# Altium schematic sheet Master.SchDoc
size A4; SheetNumber: 2; SheetTotal: 8
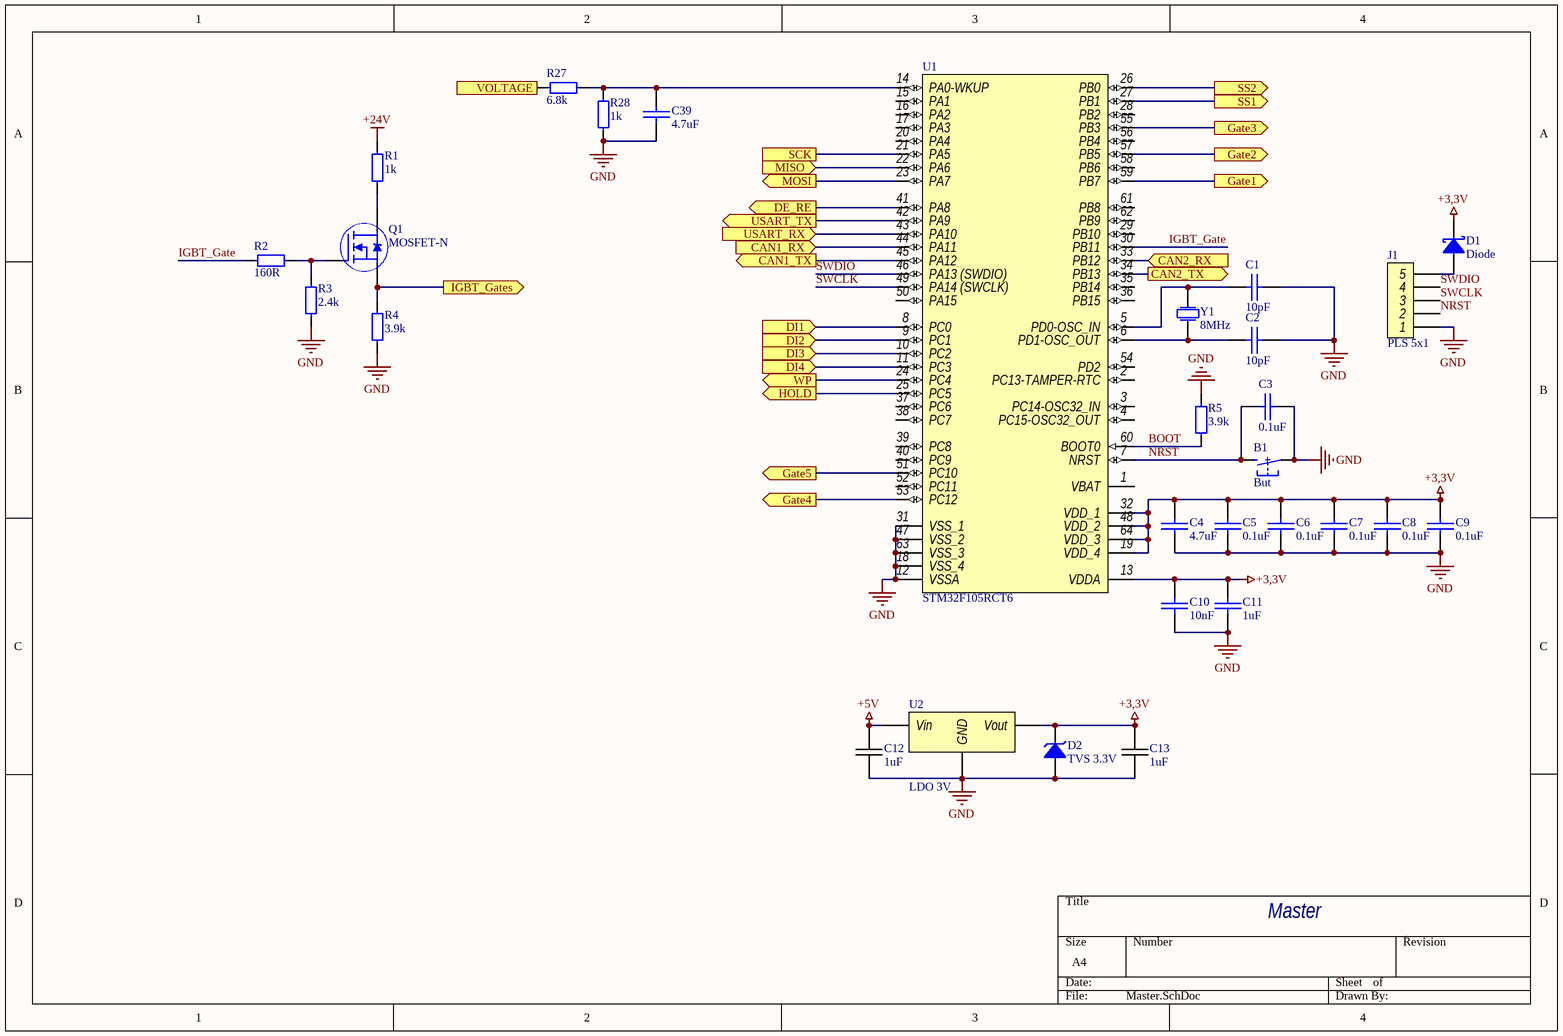
[diagram p0: Master.SchDoc]

## Parts
B1  But  [BUTTON 6x3.5]
C1  10pF  [0603 Capicator]
C2  10pF  [0603 Capicator]
C3  0.1uF  [0603 Capicator]
C4  4.7uF  [0603 Capicator]
C5  0.1uF  [0603 Capicator]
C6  0.1uF  [0603 Capicator]
C7  0.1uF  [0603 Capicator]
C8  0.1uF  [0603 Capicator]
C9  0.1uF  [0603 Capicator]
C10  10nF  [0603 Capicator]
C11  1uF  [0603 Capicator]
C12  1uF  [0603 Capicator]
C13  1uF  [0603 Capicator]
C39  4.7uF  [0603 Capicator]
D1  Diode  [sod-123]
D2  TVS 3.3V  [DO-216AA]
J1  PLS 5x1  [PLS 5x1]
Q1  MOSFET-N  [SOT-23]
R1  1k  [0603 Resistor]
R2  160R  [0603 Resistor]
R3  2.4k  [0603 Resistor]
R4  3.9k  [0603 Resistor]
R5  3.9k  [0603 Resistor]
R27  6.8k  [0603 Resistor]
R28  1k  [0603 Resistor]
U1  STM32F105RCT6  [LQFP64]
U2  LDO 3V  [SOT-23]
Y1  8MHz  [NX5032GA]

## Ports
CAN1_RX (in), CAN1_TX (out), CAN2_RX (in), CAN2_TX (out), DE_RE (out), DI1 (in), DI2 (in), DI3 (in), DI4 (in), Gate1 (out), Gate2 (out), Gate3 (out), Gate4 (out), Gate5 (out), HOLD (out), IGBT_Gates (out), MISO (in), MOSI (out), SCK, SS1 (out), SS2 (out), USART_RX (in), USART_TX (out), VOLTAGE (in), WP (out)

## Nets
+3,3V: C4.2 C5.2 C6.2 C7.2 C8.2 C9.2 C10.2 C11.2 C13.2 D1.2 D2.2 U1.13(VDDA) U1.19(VDD_4) U1.32(VDD_1) U1.48(VDD_2) U1.64(VDD_3) U2.2(Vout)
+5V: C12.2 U2.3(Vin)
+24V: R1.2
GND: B1.1 C1.2 C2.2 C3.2 C4.1 C5.1 C6.1 C7.1 C8.1 C9.1 C10.1 C11.1 C12.1 C13.1 C39.1 D2.1 J1.1 R3.1 R4.1 R5.2 R28.1 U1.12(VSSA) U1.18(VSS_4) U1.31(VSS_1) U1.47(VSS_2) U1.63(VSS_3) U2.1(GND)
BOOT: R5.1 U1.60(BOOT0)
CAN1_RX: U1.44(PA11) ; port CAN1_RX
CAN1_TX: U1.45(PA12) ; port CAN1_TX
CAN2_RX: U1.33(PB12) ; port CAN2_RX
CAN2_TX: U1.34(PB13) ; port CAN2_TX
DE_RE: U1.41(PA8) ; port DE_RE
DI1: U1.8(PC0) ; port DI1
DI2: U1.9(PC1) ; port DI2
DI3: U1.10(PC2) ; port DI3
DI4: U1.11(PC3) ; port DI4
Gate1: U1.59(PB7) ; port Gate1
Gate2: U1.57(PB5) ; port Gate2
Gate3: U1.55(PB3) ; port Gate3
Gate4: U1.53(PC12) ; port Gate4
Gate5: U1.51(PC10) ; port Gate5
HOLD: U1.25(PC5) ; port HOLD
IGBT_Gate: R2.1 U1.30(PB11)
IGBT_Gates: Q1.2(Source) R4.2 ; port IGBT_Gates
MISO: U1.22(PA6) ; port MISO
MOSI: U1.23(PA7) ; port MOSI
NRST: B1.2 C3.1 J1.2 U1.7(NRST)
SCK: U1.21(PA5) ; port SCK
SS1: U1.27(PB1) ; port SS1
SS2: U1.26(PB0) ; port SS2
SWCLK: J1.3 U1.49(PA14_(SWCLK))
SWDIO: J1.4 U1.46(PA13_(SWDIO))
USART_RX: U1.43(PA10) ; port USART_RX
USART_TX: U1.42(PA9) ; port USART_TX
VOLTAGE: R27.2 ; port VOLTAGE
WP: U1.24(PC4) ; port WP
NetC1_1: C1.1 U1.5(PD0-OSC_IN) Y1.2
NetC2_1: C2.1 U1.6(PD1-OSC_OUT) Y1.1
NetC39_2: C39.2 R27.1 R28.2 U1.14(PA0-WKUP)
NetD1_1: D1.1 J1.5
NetQ1_1: Q1.1(Gate) R2.2 R3.2
NetQ1_3: Q1.3(Drain) R1.1

Not connected (* = marked no-connect by the designer): U1 1(VBAT) 2(PC13-TAMPER-RTC) 3(PC14-OSC32_IN) 4(PC15-OSC32_OUT) 15(PA1) 16(PA2) 17(PA3) 20(PA4) 28(PB2) 29(PB10) 35(PB14) 36(PB15) 37(PC6) 38(PC7) 39(PC8) 40(PC9) 50(PA15) 52(PC11) 54(PD2) 56(PB4) 58(PB6) 61(PB8) 62(PB9)

## Notes on the sheet
- Master

## Library data of the parts
B1 = Button 2 Conn: Button 2 Conn SMD; Part Number: L-KLS7-TS3608-5.0-180; Manufacturer: KLS electronic co ltd; Type: Button; ComponentLink1Description: Chip&Dip; ComponentLink1URL: https://www.chipdip.ru/product/kls7-ts3608-5.0-180-td-02xa
C1 C2 = Cap 10pF (0603): 10pF NP0 50V 5% 0603; Manufacturer: Murata Manufacturing; Part Number: GRM1885C1H100JA01D; Type: Capacitor; ComponentLink1Description: Chip&Dip; ComponentLink1URL: https://www.chipdip.ru/product/grm1885c1h100j
C3 C5-C9 = Cap 0.1uF (0603): 0.1uF X7R 16V 10% 0603; Manufacturer: Murata Manufacturing; Part Number: GRM188R71C104KA01D; Type: Capacitor; ComponentLink1Description: Chip&Dip; ComponentLink1URL: https://www.chipdip.ru/product/grm188r71c104ka01d
C4 C39 = Cap 4.7uF (0603): 4.7uF X5R 25V 10% 0603; Manufacturer: Murata Manufacturing; Part Number: GRM188R61E475KE11D; Type: Capacitor; ComponentLink1Description: Chip&Dip; ComponentLink1URL: https://www.chipdip.ru/product0/9000348448
C10 = Cap 10nF (0603): 10nF X7R  100V 10% 0603; Manufacturer: Murata Manufacturing; Part Number: GRM188R72A103KA01D; Type: Capacitor; ComponentLink1Description: Chip&Dip; ComponentLink1URL: https://www.chipdip.ru/product/grm188r72a103ka01d
C11-C13 = Cap 1uF (0603): 1uF X5R 25V 10% 0603; Manufacturer: Murata Manufacturing; Part Number: GRM188R61E105KAADD; Type: Capacitor; ComponentLink1Description: Chip&Dip; ComponentLink1URL: https://www.chipdip.ru/product/grm188r61e105k
D1 = Diode Schottky (SOD-123): 0.5 A, Low Forward Voltage less than 385 mV, 400 mW Power Dissipation Package; Part Number: MBR0520L; Manufacturer: ON Semiconductor; Type: Diode; ComponentLink1Description: DataSheet; ComponentLink1URL: http://www.farnell.com/datasheets/1875336.pdf; ComponentLink2Description: Chip&Dip; ComponentLink2URL: https://www.chipdip.ru/product/mbr0520l
D2 = TVS Diode 3.3V [SM2T]: High peak pulse power: 200 W (10/1000 μs); Part Number: SM2T3V3A; Manufacturer: STMicroelectronics; Type: Diode; ComponentLink1Description: DataSheet; ComponentLink1URL: https://www.st.com/resource/en/datasheet/sm2t3v3a.pdf; ComponentLink2Description: Chip&Dip; ComponentLink2URL: https://www.chipdip.ru/product0/8283670575
J1 = Conn 5 (PLS): Header, 5-Pin
Q1 = MOSFET-N [IRLML]: VDS 30V,  VGS Max ± 20V, RDS 27-40mΩ,; Part Number: IRLML0030TRPBF; Manufacturer: Infineon Technologies; Type: Transistor; ComponentLink1Description: DataSheet; ComponentLink1URL: https://static.chipdip.ru/lib/300/DOC000300382.pdf; ComponentLink2Description: Chip&Dip; ComponentLink2URL: https://www.chipdip.ru/product/irlml0030trpbf
R1 R28 = Res 1k (0603): 0.1W 0603 1k, 1%; Part Number: RC0603FR-071KL; Manufacturer: Taiwan; Type: Resistor; ComponentLink1Description: Chip&Dip; ComponentLink1URL: https://www.chipdip.ru/product0/9000079676
R2 = Res 160R (0603): 0.1W 0603 160R, 1%; Part Number: RC0603FR-07160RL; Manufacturer: Taiwan; Type: Resistor; ComponentLink1Description: Chip&Dip; ComponentLink1URL: https://www.chipdip.ru/product/0.1w-0603-160-om-1
R3 = Res 2.4k (0603): 0.1W 0603 2.4k, 1%; Part Number: RC0603FR-072K4L; Manufacturer: Taiwan; Type: Resistor; ComponentLink1Description: Chip&Dip; ComponentLink1URL: https://www.chipdip.ru/product0/9000079721
R4 R5 = Res 3.9k (0603): 0.1W 0603 3.9k, 1%; Part Number: RC0603FR-073K9L; Manufacturer: Taiwan; Type: Resistor; ComponentLink1Description: Chip&Dip; ComponentLink1URL: https://www.chipdip.ru/product0/9000079726
R27 = Res 6.8k (0603): 0.1W 0603 6.8k, 1%; Part Number: RC0603FR-076K8L; Manufacturer: Taiwan; Type: Resistor; ComponentLink1Description: Chip&Dip; ComponentLink1URL: https://www.chipdip.ru/product/0.1w-0603-6.8-kom-1
U1 = STM32F105RCT6: MCU ARM 256KB FLASH MEM 64-LQFP; Manufacturer: STMicroelectronics; Part Number: STM32F105RCT6; ComponentLink1Description: DataSheet; ComponentLink1URL: https://static.chipdip.ru/lib/375/DOC011375072.pdf; ComponentLink2Description: Chip&Dip; ComponentLink2URL: https://www.chipdip.ru/product/stm32f105rct6; Type: IC
U2 = LDO 3,3V [MCP]: MCP1702 Low Dropout Voltage Regulator. The input operating range is specifiedfrom 2.7V to 13.2V; Part Number: MCP1702T-3002E/CB; Manufacturer: Microchip; ComponentLink1Description: DataSheet; ComponentLink1URL: https://static.chipdip.ru/lib/986/DOC003986671.pdf; ComponentLink2Description: Chip&Dip; ComponentLink2URL: https://www.chipdip.ru/product/mcp1702t-3002e-cb-microchip
Y1 = Crystal 8MHz: Crystal NX5032GA; Manufacturer: Nihon Dempa Kogio (NDK); Part Number: NX5032GA-8MHz; Type: Crystal; ComponentLink1Description: Chip&Dip; ComponentLink1URL: https://www.chipdip.ru/product0/9000523954